# Altium project stm32f407_DB_PCB_Project.PrjPcb
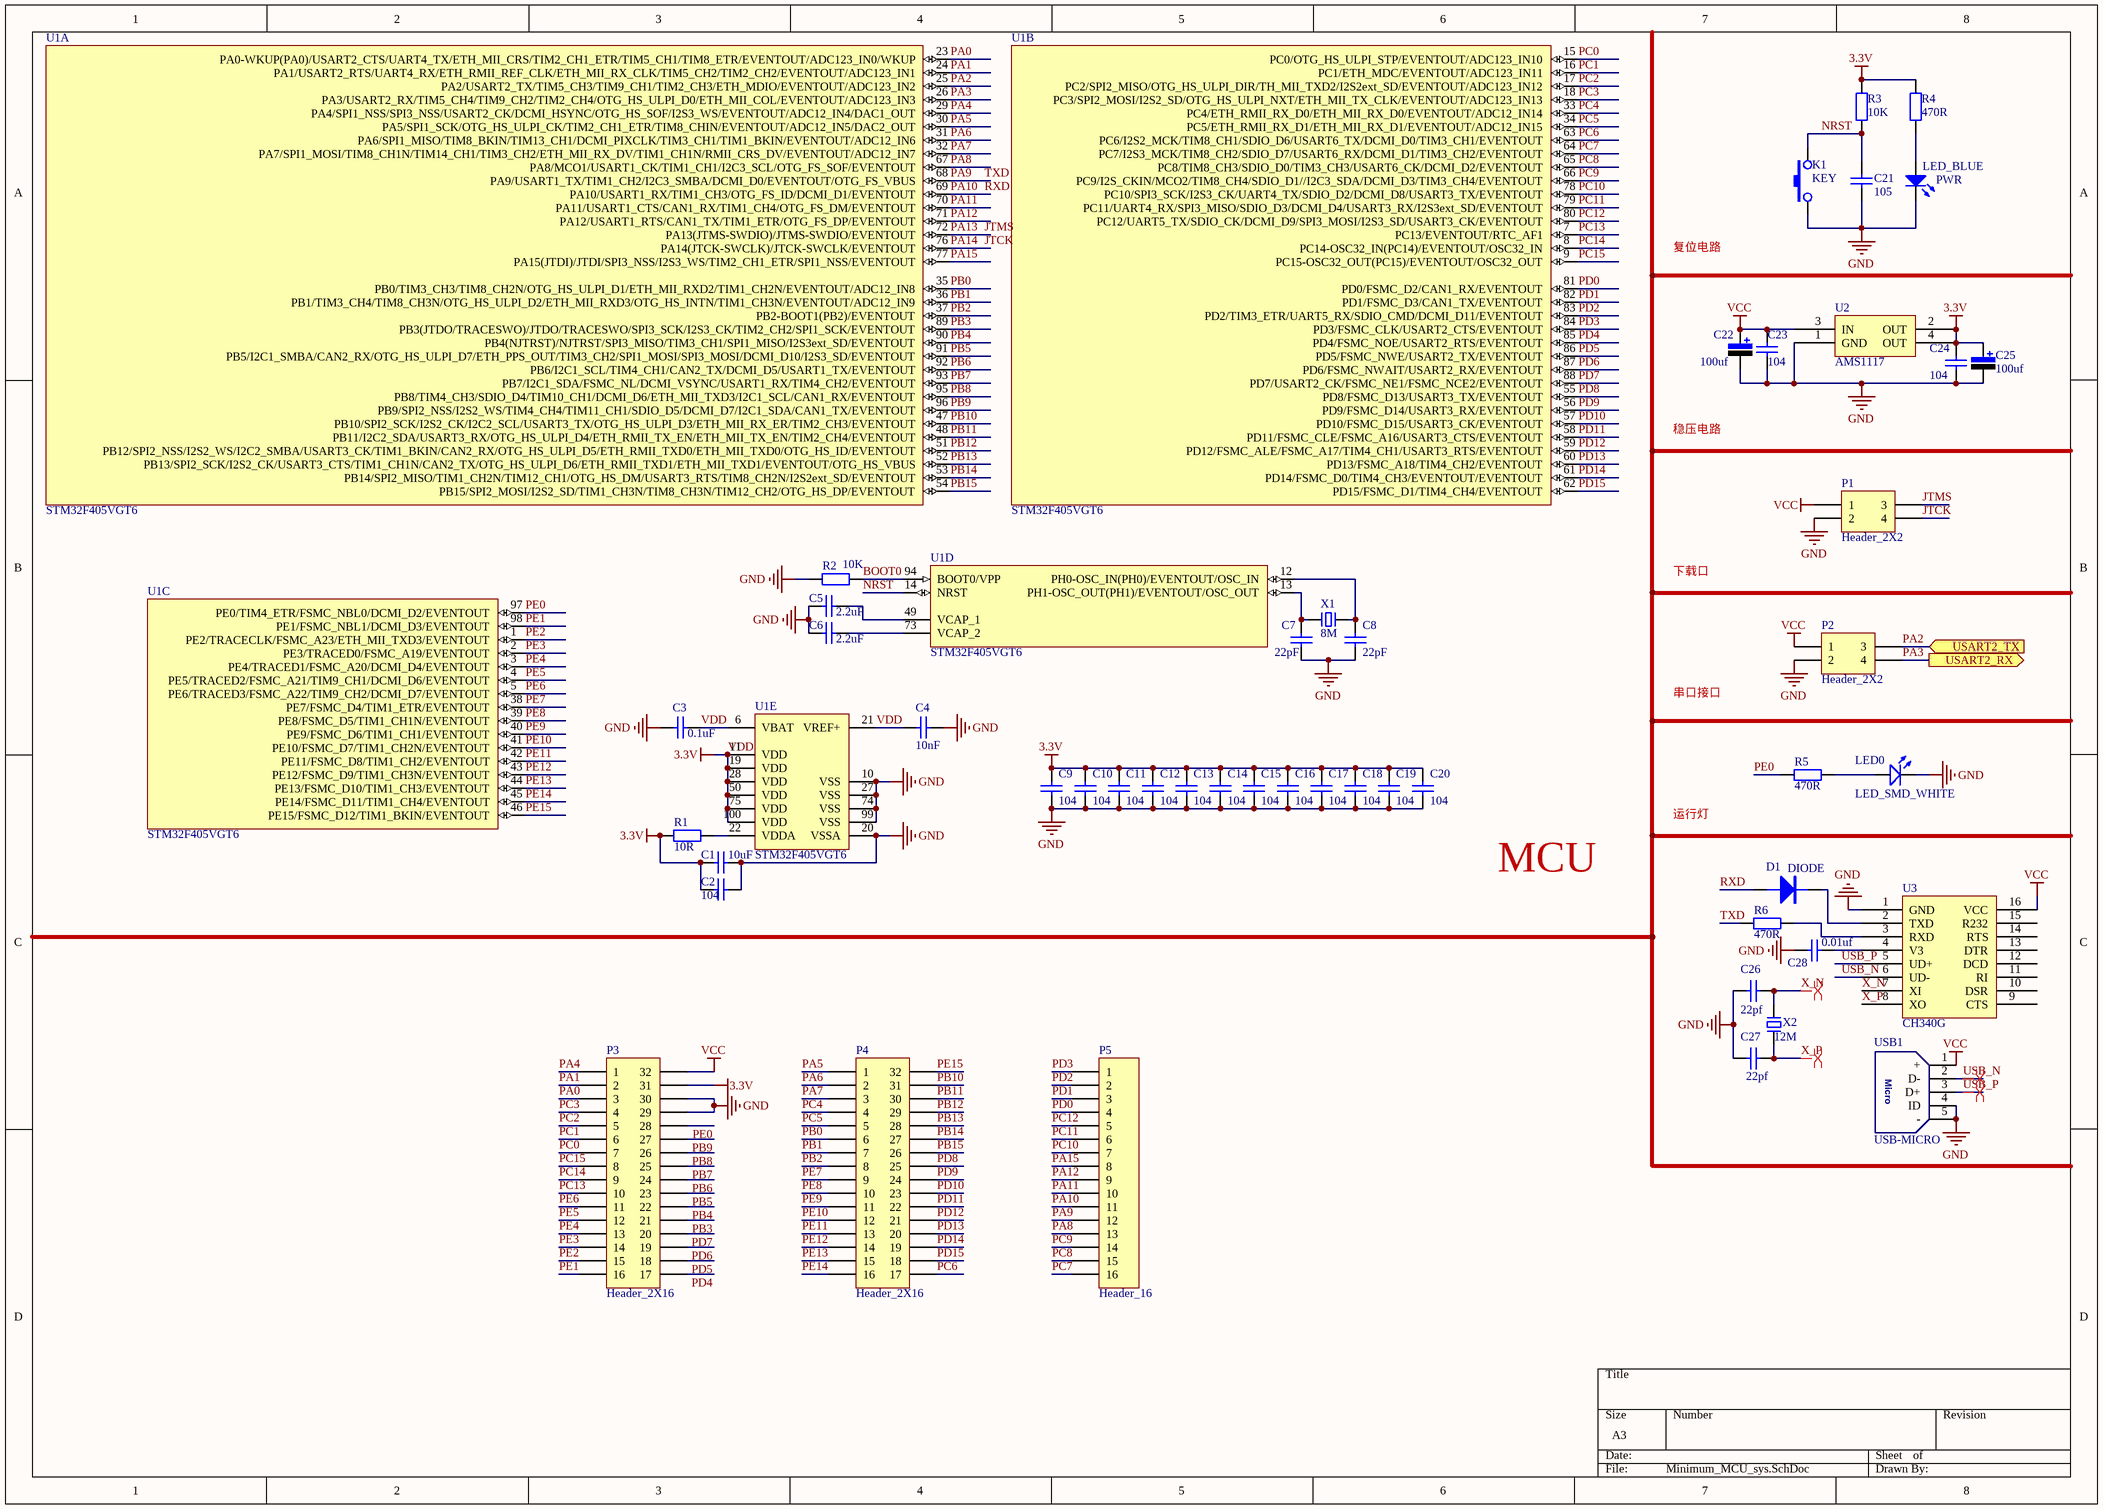
[diagram p0: Minimum_MCU_sys.SchDoc]
1 sheet, 49 parts. Net scope: flat (ports and power ports of the same name join across sheets).
Board file: stm32f407_DB.PcbDoc

## Sheet Minimum_MCU_sys.SchDoc
size A3

### Parts
C1  10uF  [Cap-0603]
C2  104  [Cap-0603]
C3  0.1uF  [Cap-0603]
C4  10nF  [Cap-0603]
C5  2.2uF  [Cap-0603]
C6  2.2uF  [Cap-0603]
C7  22pF  [Cap-0603]
C8  22pF  [Cap-0603]
C9  104  [Cap-0603]
C10  104  [Cap-0603]
C11  104  [Cap-0603]
C12  104  [Cap-0603]
C13  104  [Cap-0603]
C14  104  [Cap-0603]
C15  104  [Cap-0603]
C16  104  [Cap-0603]
C17  104  [Cap-0603]
C18  104  [Cap-0603]
C19  104  [Cap-0603]
C20  104  [Cap-0603]
C21  105  [Cap-0603]
C22  100uf  [tan_cap_C]
C23  104  [Cap-0603-M]
C24  104  [Cap-0603-M]
C25  100uf  [tan_cap_C]
C26  22pf  [Cap-0603]
C27  22pf  [Cap-0603]
C28  0.01uf  [Cap-0603]
D1  DIODE  [SOD-523]
K1  KEY  [SW-SMD-2X4]
LED0  LED_SMD_WHITE  [LED_0603_W]
P1  Header_2X2  [Header_SMD_2.54X2]
P2  Header_2X2  [Header_SMD_2.54X2]
P3  Header_2X16  [Header 2.54_2X16]
P4  Header_2X16  [Header 2.54_2X16]
P5  Header_16  [Header 2.54X16]
PWR  LED_BLUE  [LED_0603_B]
R1  10R  [Res-0603]
R2  10K  [Res-0603]
R3  10K  [Res-0603]
R4  470R  [Res-0603]
R5  470R  [Res-0603]
R6  470R  [Res-0603]
U1  STM32F405VGT6  [LQFP100_V]  (parts A,B,C,D,E of 5)
U2  AMS1117  [AMS1117]
U3  CH340G  [SOP127P590X265-16N]
USB1  USB-MICRO  [USB-MICRO-SMD_C]
X1  8M  [OSC 5032-2P]
X2  12M  [OSC 5032-2P]

### Ports
USART2_RX (out), USART2_TX (in)

### Nets
GND: C1.2 C2.2 C3.1 C4.1 C5.1 C6.1 C7.2 C8.1 C9.1 C10.1 C11.1 C12.1 C13.1 C14.1 C15.1 C16.1 C17.1 C18.1 C19.1 C20.1 C21.1 C22.2 C23.1 C24.1 C25.2 C26.2 C27.2 C28.1 K1.1 LED0.2(K) P1.2 P2.2 P3.29 P3.30 PWR.2(K) R2.1 U1.10(VSS) U1.20(VSSA) U1.27(VSS) U1.74(VSS) U1.99(VSS) U2.1(GND) U3.1(GND) USB1.4(ID) USB1.5(-)
VCC: C22.1 C23.2 P1.1 P2.1 P3.32 U2.3(IN) U3.16(VCC) USB1.1(+)
VDD: C1.1 C2.1 C3.2 C4.2 C9.2 C10.2 C11.2 C12.2 C13.2 C14.2 C15.2 C16.2 C17.2 C18.2 C19.2 C20.2 C24.2 C25.1 P3.31 R1.1 R3.1 R4.1 U1.6(VBAT) U1.11(VDD) U1.19(VDD) U1.21(VREF+) U1.28(VDD) U1.50(VDD) U1.75(VDD) U1.100(VDD) U2.2(OUT) U2.4(OUT)  [also labelled 3.3V]
BOOT0: R2.2 U1.94(BOOT0/VPP)
JTCK: P1.4 U1.76(PA14(JTCK-SWCLK)/JTCK-SWCLK/EVENTOUT)  [also labelled PA14]
JTMS: P1.3 U1.72(PA13(JTMS-SWDIO)/JTMS-SWDIO/EVENTOUT)  [also labelled PA13]
NRST: C21.2 K1.3 R3.2 U1.14(NRST)
PA0: P3.3 U1.23(PA0-WKUP(PA0)/USART2_CTS/UART4_TX/ETH_MII_CRS/TIM2_CH1_ETR/TIM5_CH1/TIM8_ETR/EVENTOUT/ADC123_IN0/WKUP)
PA1: P3.2 U1.24(PA1/USART2_RTS/UART4_RX/ETH_RMII_REF_CLK/ETH_MII_RX_CLK/TIM5_CH2/TIM2_CH2/EVENTOUT/ADC123_IN1)
PA2: P2.3 U1.25(PA2/USART2_TX/TIM5_CH3/TIM9_CH1/TIM2_CH3/ETH_MDIO/EVENTOUT/ADC123_IN2) ; port USART2_TX
PA3: P2.4 U1.26(PA3/USART2_RX/TIM5_CH4/TIM9_CH2/TIM2_CH4/OTG_HS_ULPI_D0/ETH_MII_COL/EVENTOUT/ADC123_IN3) ; port USART2_RX
PA4: P3.1 U1.29(PA4/SPI1_NSS/SPI3_NSS/USART2_CK/DCMI_HSYNC/OTG_HS_SOF/I2S3_WS/EVENTOUT/ADC12_IN4/DAC1_OUT)
PA5: P4.1 U1.30(PA5/SPI1_SCK/OTG_HS_ULPI_CK/TIM2_CH1_ETR/TIM8_CHIN/EVENTOUT/ADC12_IN5/DAC2_OUT)
PA6: P4.2 U1.31(PA6/SPI1_MISO/TIM8_BKIN/TIM13_CH1/DCMI_PIXCLK/TIM3_CH1/TIM1_BKIN/EVENTOUT/ADC12_IN6)
PA7: P4.3 U1.32(PA7/SPI1_MOSI/TIM8_CH1N/TIM14_CH1/TIM3_CH2/ETH_MII_RX_DV/TIM1_CH1N/RMII_CRS_DV/EVENTOUT/ADC12_IN7)
PA8: P5.13 U1.67(PA8/MCO1/USART1_CK/TIM1_CH1/I2C3_SCL/OTG_FS_SOF/EVENTOUT)
PA9: P5.12 R6.1 U1.68(PA9/USART1_TX/TIM1_CH2/I2C3_SMBA/DCMI_D0/EVENTOUT/OTG_FS_VBUS)  [also labelled TXD]
PA10: D1.A P5.11 U1.69(PA10/USART1_RX/TIM1_CH3/OTG_FS_ID/DCMI_D1/EVENTOUT)  [also labelled RXD]
PA11: P5.10 U1.70(PA11/USART1_CTS/CAN1_RX/TIM1_CH4/OTG_FS_DM/EVENTOUT)
PA12: P5.9 U1.71(PA12/USART1_RTS/CAN1_TX/TIM1_ETR/OTG_FS_DP/EVENTOUT)
PA15: P5.8 U1.77(PA15(JTDI)/JTDI/SPI3_NSS/I2S3_WS/TIM2_CH1_ETR/SPI1_NSS/EVENTOUT)
PB0: P4.6 U1.35(PB0/TIM3_CH3/TIM8_CH2N/OTG_HS_ULPI_D1/ETH_MII_RXD2/TIM1_CH2N/EVENTOUT/ADC12_IN8)
PB1: P4.7 U1.36(PB1/TIM3_CH4/TIM8_CH3N/OTG_HS_ULPI_D2/ETH_MII_RXD3/OTG_HS_INTN/TIM1_CH3N/EVENTOUT/ADC12_IN9)
PB2: P4.8 U1.37(PB2-BOOT1(PB2)/EVENTOUT)
PB3: P3.21 U1.89(PB3(JTDO/TRACESWO)/JTDO/TRACESWO/SPI3_SCK/I2S3_CK/TIM2_CH2/SPI1_SCK/EVENTOUT)
PB4: P3.22 U1.90(PB4(NJTRST)/NJTRST/SPI3_MISO/TIM3_CH1/SPI1_MISO/I2S3ext_SD/EVENTOUT)
PB5: P3.23 U1.91(PB5/I2C1_SMBA/CAN2_RX/OTG_HS_ULPI_D7/ETH_PPS_OUT/TIM3_CH2/SPI1_MOSI/SPI3_MOSI/DCMI_D10/I2S3_SD/EVENTOUT)
PB6: P3.24 U1.92(PB6/I2C1_SCL/TIM4_CH1/CAN2_TX/DCMI_D5/USART1_TX/EVENTOUT)
PB7: P3.25 U1.93(PB7/I2C1_SDA/FSMC_NL/DCMI_VSYNC/USART1_RX/TIM4_CH2/EVENTOUT)
PB8: P3.26 U1.95(PB8/TIM4_CH3/SDIO_D4/TIM10_CH1/DCMI_D6/ETH_MII_TXD3/I2C1_SCL/CAN1_RX/EVENTOUT)
PB9: P3.27 U1.96(PB9/SPI2_NSS/I2S2_WS/TIM4_CH4/TIM11_CH1/SDIO_D5/DCMI_D7/I2C1_SDA/CAN1_TX/EVENTOUT)
PB10: P4.31 U1.47(PB10/SPI2_SCK/I2S2_CK/I2C2_SCL/USART3_TX/OTG_HS_ULPI_D3/ETH_MII_RX_ER/TIM2_CH3/EVENTOUT)
PB11: P4.30 U1.48(PB11/I2C2_SDA/USART3_RX/OTG_HS_ULPI_D4/ETH_RMII_TX_EN/ETH_MII_TX_EN/TIM2_CH4/EVENTOUT)
PB12: P4.29 U1.51(PB12/SPI2_NSS/I2S2_WS/I2C2_SMBA/USART3_CK/TIM1_BKIN/CAN2_RX/OTG_HS_ULPI_D5/ETH_RMII_TXD0/ETH_MII_TXD0/OTG_HS_ID/EVENTOUT)
PB13: P4.28 U1.52(PB13/SPI2_SCK/I2S2_CK/USART3_CTS/TIM1_CH1N/CAN2_TX/OTG_HS_ULPI_D6/ETH_RMII_TXD1/ETH_MII_TXD1/EVENTOUT/OTG_HS_VBUS)
PB14: P4.27 U1.53(PB14/SPI2_MISO/TIM1_CH2N/TIM12_CH1/OTG_HS_DM/USART3_RTS/TIM8_CH2N/I2S2ext_SD/EVENTOUT)
PB15: P4.26 U1.54(PB15/SPI2_MOSI/I2S2_SD/TIM1_CH3N/TIM8_CH3N/TIM12_CH2/OTG_HS_DP/EVENTOUT)
PC0: P3.7 U1.15(PC0/OTG_HS_ULPI_STP/EVENTOUT/ADC123_IN10)
PC1: P3.6 U1.16(PC1/ETH_MDC/EVENTOUT/ADC123_IN11)
PC2: P3.5 U1.17(PC2/SPI2_MISO/OTG_HS_ULPI_DIR/TH_MII_TXD2/I2S2ext_SD/EVENTOUT/ADC123_IN12)
PC3: P3.4 U1.18(PC3/SPI2_MOSI/I2S2_SD/OTG_HS_ULPI_NXT/ETH_MII_TX_CLK/EVENTOUT/ADC123_IN13)
PC4: P4.4 U1.33(PC4/ETH_RMII_RX_D0/ETH_MII_RX_D0/EVENTOUT/ADC12_IN14)
PC5: P4.5 U1.34(PC5/ETH_RMII_RX_D1/ETH_MII_RX_D1/EVENTOUT/ADC12_IN15)
PC6: P4.17 U1.63(PC6/I2S2_MCK/TIM8_CH1/SDIO_D6/USART6_TX/DCMI_D0/TIM3_CH1/EVENTOUT)
PC7: P5.16 U1.64(PC7/I2S3_MCK/TIM8_CH2/SDIO_D7/USART6_RX/DCMI_D1/TIM3_CH2/EVENTOUT)
PC8: P5.15 U1.65(PC8/TIM8_CH3/SDIO_D0/TIM3_CH3/USART6_CK/DCMI_D2/EVENTOUT)
PC9: P5.14 U1.66(PC9/I2S_CKIN/MCO2/TIM8_CH4/SDIO_D1//I2C3_SDA/DCMI_D3/TIM3_CH4/EVENTOUT)
PC10: P5.7 U1.78(PC10/SPI3_SCK/I2S3_CK/UART4_TX/SDIO_D2/DCMI_D8/USART3_TX/EVENTOUT)
PC11: P5.6 U1.79(PC11/UART4_RX/SPI3_MISO/SDIO_D3/DCMI_D4/USART3_RX/I2S3ext_SD/EVENTOUT)
PC12: P5.5 U1.80(PC12/UART5_TX/SDIO_CK/DCMI_D9/SPI3_MOSI/I2S3_SD/USART3_CK/EVENTOUT)
PC13: P3.10 U1.7(PC13/EVENTOUT/RTC_AF1)
PC14: P3.9 U1.8(PC14-OSC32_IN(PC14)/EVENTOUT/OSC32_IN)
PC15: P3.8 U1.9(PC15-OSC32_OUT(PC15)/EVENTOUT/OSC32_OUT)
PD0: P5.4 U1.81(PD0/FSMC_D2/CAN1_RX/EVENTOUT)
PD1: P5.3 U1.82(PD1/FSMC_D3/CAN1_TX/EVENTOUT)
PD2: P5.2 U1.83(PD2/TIM3_ETR/UART5_RX/SDIO_CMD/DCMI_D11/EVENTOUT)
PD3: P5.1 U1.84(PD3/FSMC_CLK/USART2_CTS/EVENTOUT)
PD4: P3.17 U1.85(PD4/FSMC_NOE/USART2_RTS/EVENTOUT)
PD5: P3.18 U1.86(PD5/FSMC_NWE/USART2_TX/EVENTOUT)
PD6: P3.19 U1.87(PD6/FSMC_NWAIT/USART2_RX/EVENTOUT)
PD7: P3.20 U1.88(PD7/USART2_CK/FSMC_NE1/FSMC_NCE2/EVENTOUT)
PD8: P4.25 U1.55(PD8/FSMC_D13/USART3_TX/EVENTOUT)
PD9: P4.24 U1.56(PD9/FSMC_D14/USART3_RX/EVENTOUT)
PD10: P4.23 U1.57(PD10/FSMC_D15/USART3_CK/EVENTOUT)
PD11: P4.22 U1.58(PD11/FSMC_CLE/FSMC_A16/USART3_CTS/EVENTOUT)
PD12: P4.21 U1.59(PD12/FSMC_ALE/FSMC_A17/TIM4_CH1/USART3_RTS/EVENTOUT)
PD13: P4.20 U1.60(PD13/FSMC_A18/TIM4_CH2/EVENTOUT)
PD14: P4.19 U1.61(PD14/FSMC_D0/TIM4_CH3/EVENTOUT/EVENTOUT)
PD15: P4.18 U1.62(PD15/FSMC_D1/TIM4_CH4/EVENTOUT)
PE0: P3.28 R5.1 U1.97(PE0/TIM4_ETR/FSMC_NBL0/DCMI_D2/EVENTOUT)
PE1: P3.16 U1.98(PE1/FSMC_NBL1/DCMI_D3/EVENTOUT)
PE2: P3.15 U1.1(PE2/TRACECLK/FSMC_A23/ETH_MII_TXD3/EVENTOUT)
PE3: P3.14 U1.2(PE3/TRACED0/FSMC_A19/EVENTOUT)
PE4: P3.13 U1.3(PE4/TRACED1/FSMC_A20/DCMI_D4/EVENTOUT)
PE5: P3.12 U1.4(PE5/TRACED2/FSMC_A21/TIM9_CH1/DCMI_D6/EVENTOUT)
PE6: P3.11 U1.5(PE6/TRACED3/FSMC_A22/TIM9_CH2/DCMI_D7/EVENTOUT)
PE7: P4.9 U1.38(PE7/FSMC_D4/TIM1_ETR/EVENTOUT)
PE8: P4.10 U1.39(PE8/FSMC_D5/TIM1_CH1N/EVENTOUT)
PE9: P4.11 U1.40(PE9/FSMC_D6/TIM1_CH1/EVENTOUT)
PE10: P4.12 U1.41(PE10/FSMC_D7/TIM1_CH2N/EVENTOUT)
PE11: P4.13 U1.42(PE11/FSMC_D8/TIM1_CH2/EVENTOUT)
PE12: P4.14 U1.43(PE12/FSMC_D9/TIM1_CH3N/EVENTOUT)
PE13: P4.15 U1.44(PE13/FSMC_D10/TIM1_CH3/EVENTOUT)
PE14: P4.16 U1.45(PE14/FSMC_D11/TIM1_CH4/EVENTOUT)
PE15: P4.32 U1.46(PE15/FSMC_D12/TIM1_BKIN/EVENTOUT)
USB_N: U3.6(UD-) USB1.2(D-)
USB_P: U3.5(UD+) USB1.3(D+)
X_N: C26.1 U3.7(XI) X2.1
X_P: C27.1 U3.8(XO) X2.2
NetC5_2: C5.2 U1.49(VCAP_1)
NetC6_2: C6.2 U1.73(VCAP_2)
NetC7_1: C7.1 U1.13(PH1-OSC_OUT(PH1)/EVENTOUT/OSC_OUT) X1.2
NetC8_2: C8.2 U1.12(PH0-OSC_IN(PH0)/EVENTOUT/OSC_IN) X1.1
NetC28_2: C28.2 U3.4(V3)
NetD1_K: D1.K U3.2(TXD)
NetLED0_1: LED0.1(A) R5.2
NetPWR_1: PWR.1(A) R4.2
NetR1_2: R1.2 U1.22(VDDA)
NetR6_2: R6.2 U3.3(RXD)

Not connected (* = marked no-connect by the designer): U3 9(CTS) 10(DSR) 11(RI) 12(DCD) 13(DTR) 14(RTS) 15(R232)

### Layout directives
differential pair: USB_N, USB_P, X_N, X_P

### Notes on the sheet
- 复位电路
- 稳压电路
- 下载口
- 串口接口
- 运行灯
- MCU
- (in symbol USB-MICRO) Micro

### Library data of the parts
C1-C20 = CAP: 贴片陶瓷电容
C21 C23 C24 C26 C27 = CAP
C22 C25 = tan_cap
C28 = Cap
D1 = DIODE: 普通二极管
LED0 = LED_SMD_WHITE: 发光二极管; ComponentLink1Description: 供应商链接; ComponentLink1URL: http://www.szlcsc.com/product/details_2663.html; Package: 0603; Supplier: LC; SuppliersPartNumber: C2290
PWR = LED_SMD_BLUE: 发光二极管; ComponentLink1Description: 供应商链接; ComponentLink1URL: http://www.szlcsc.com/product/details_73150.html; Package: 0603; Supplier: LC; SuppliersPartNumber: C72041
R1-R6 = RES: 贴片电阻
U1 = STM32F405VGT6: ARM Cortex-M4 32b MCU+FPU, 210DMIP, 1024 kB Flash, 192+4 kB RAM, 82 I/Os, 100-pin LQFP, -40 to +85癈, Tray; Internal RAM: 192kB; Operating Frequency (Processor Speed): 168MHz; A/D Converter: 16x12-bit; D/A Converter: 2x12-bit; 16-bit Timers (IC/OC/PWM): 12x16-bit(24/24/30); 32-bit Timer (IC/OC/PWM): 2x32-bit (8/8/8); Other Timer Functions: 2xWDG, RTC, 24-bit down counter; Serial Interface: 3xSPI/2xI2S/2xI2C/3xUSART(IrDa, ISO7816)/3xUART/1xUSB OTG FS/HS, 2xCAN/ SDIO; DatasheetVersion: rev2, Jan-2012; PackageVersion: 2012; PackageReference: LQFP100; PackageDescription: 100-Pin Low Profile Quad Flat Package, 14x14 mm Body, 0.5 mm Pitch; ComponentLink1Description: Manufacturer URL; ComponentLink1URL: http://www.st.com/; ComponentLink2Description: STM32F405/7 Datasheet; ComponentLink2URL: http://www.st.com/internet/com/TECHNICAL_RESOURCES/TECHNICAL_LITERATURE/DATASHEET/DM00037051.pdf; ComponentLink3Description: STM32F4 Web Page; ComponentLink3URL: http://www.st.com/internet/mcu/subclass/1521.jsp
X1 X2 = XTAL-2P: 2脚无源脚晶振